# Altium project pca10143.PrjPCB (part 4 of 5)

## Sheet pca10143_sheet6_power_supply.SchDoc: PCA10143 - Power Supply
size A3; Organization: Nordic Semiconductor; DocumentNumber: 6; Revision: 0.7.2; SheetNumber: 6; SheetTotal: 7; Author: HANY; CompanyName: Nordic Semiconductor; ProjectName: nRF7002 Development Kit
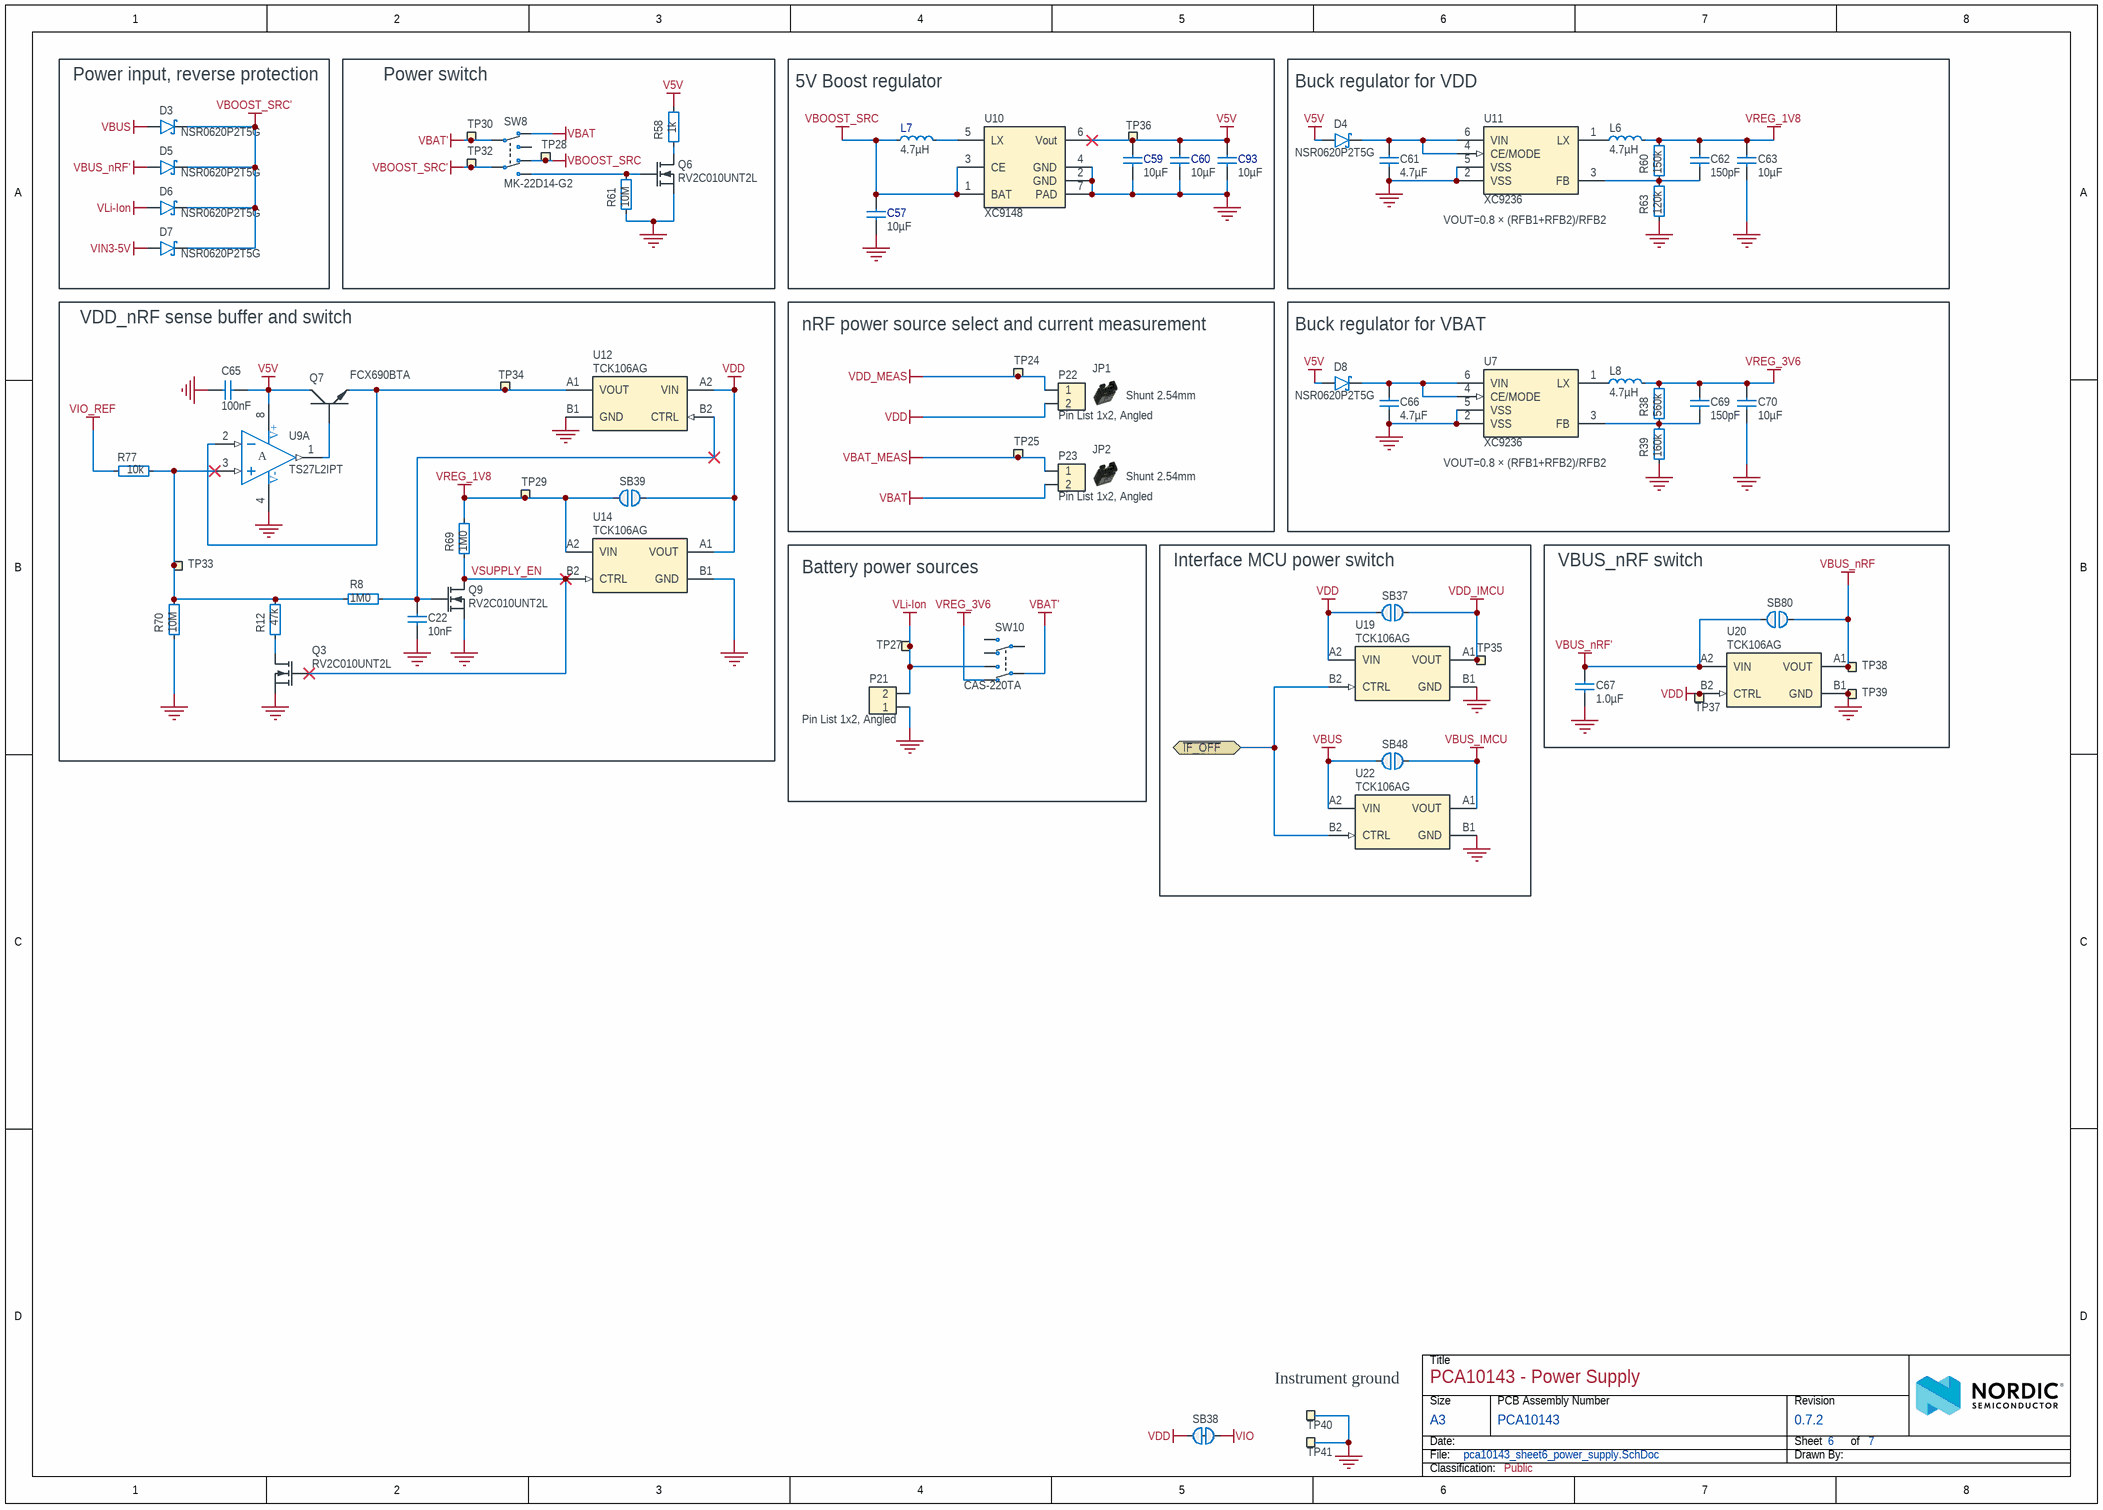
[diagram p5: pca10143_sheet6_power_supply.SchDoc]

### Parts
C22  10nF  [CAPC0603X03L_C]
C57  10µF  [CAPC1608X06L]
C59  10µF  [CAPC1608X06L]
C60  10µF  [CAPC1608X06L]
C61  4.7µF  [CAPC1005X04L]
C62  150pF  [CAPC0603X03L_C]
C63  10µF  [CAPC1608X06L]
C65  100nF  [CAPC0603X03L_C]
C66  4.7µF  [CAPC1005X04L]
C67  1.0µF  [CAPC1608X06L]
C69  150pF  [CAPC0603X03L_C]
C70  10µF  [CAPC1608X06L]
C93  10µF  [CAPC1608X06L]
D3  NSR0620P2T5G  [SODFL100X40-2N]
D4  NSR0620P2T5G  [SODFL100X40-2N]
D5  NSR0620P2T5G  [SODFL100X40-2N]
D6  NSR0620P2T5G  [SODFL100X40-2N]
D7  NSR0620P2T5G  [SODFL100X40-2N]
D8  NSR0620P2T5G  [SODFL100X40-2N]
JP1  Shunt 2.54mm  [Shunt_2.54mm_Horizontal]
JP2  Shunt 2.54mm  [Shunt_2.54mm_Horizontal]
L6  4.7µH  [TY-NR3015]
L7  4.7µH  [VLS3012HBX]
L8  4.7µH  [TY-NR3015]
P21  Pin List 1x2, Angled  [LIST_ANG_1x2-SMD-2.54MM]
P22  Pin List 1x2, Angled  [LIST_ANG_1x2-SMD-2.54MM]
P23  Pin List 1x2, Angled  [LIST_ANG_1x2-SMD-2.54MM]
Q3  RV2C010UNT2L  [DFN65P100X40-3L]
Q6  RV2C010UNT2L  [DFN65P100X40-3L]
Q7  FCX690BTA  [SOT89-150P409X160-3N]
Q9  RV2C010UNT2L  [DFN65P100X40-3L]
R8  1M0  [RESC0603X03L_C]
R12  47k  [RESC0603X03L_C]
R38  560k  [RESC0603X03L_C]
R39  160k  [RESC0603X03L_C]
R58  1k  [RESC0603X03L_C]
R60  150k  [RESC0603X03L_C]
R61  10M  [RESC0603X03L_C]
R63  120k  [RESC0603X03L_C]
R69  1M0  [RESC0603X03L_C]
R70  10M  [RESC0603X03L_C]
R77  10k  [RESC0603X03L_C]
SB37  Solderbridge  [Solderbridge]  (value not drawn)  (no BOM)
SB38  Solderbridge  [Solderbridge_Shorted]  (value not drawn)  (net tie, no BOM)
SB39  Solderbridge  [Solderbridge]  (value not drawn)  (no BOM)
SB48  Solderbridge  [Solderbridge]  (value not drawn)  (no BOM)
SB80  Solderbridge  [Solderbridge]  (value not drawn)  (no BOM)
SW8  MK-22D14-G2  [MK-22D14-G2]
SW10  CAS-220TA  [CAS-220TA]
TP24  Ø1.5mm,SMD  [TP_SMD_D1.5mm]  (value not drawn)  (no BOM)
TP25  Ø1.5mm,SMD  [TP_SMD_D1.5mm]  (value not drawn)  (no BOM)
TP27  Ø1.5mm,SMD  [TP_SMD_D1.5mm]  (value not drawn)  (no BOM)
TP28  Ø1.5mm,SMD  [TP_SMD_D1.5mm]  (value not drawn)  (no BOM)
TP29  Ø1.0mm,SMD  [TP_SMD_D1.0mm]  (value not drawn)  (no BOM)
TP30  Ø1.5mm,SMD  [TP_SMD_D1.5mm]  (value not drawn)  (no BOM)
TP32  Ø1.5mm,SMD  [TP_SMD_D1.5mm]  (value not drawn)  (no BOM)
TP33  Ø1.0mm,SMD  [TP_SMD_D1.0mm]  (value not drawn)  (no BOM)
TP34  Ø1.0mm,SMD  [TP_SMD_D1.0mm]  (value not drawn)  (no BOM)
TP35  Ø1.5mm,SMD  [TP_SMD_D1.5mm]  (value not drawn)  (no BOM)
TP36  Ø1.0mm,SMD  [TP_SMD_D1.0mm]  (value not drawn)  (no BOM)
TP37  Ø1.5mm,SMD  [TP_SMD_D1.5mm]  (value not drawn)  (no BOM)
TP38  Ø1.5mm,SMD  [TP_SMD_D1.5mm]  (value not drawn)  (no BOM)
TP39  Ø1.5mm,SMD  [TP_SMD_D1.5mm]  (value not drawn)  (no BOM)
TP40  TP  [TESTPAD-TH]  (value not drawn)  (no BOM)
TP41  TP  [TESTPAD-TH]  (value not drawn)  (no BOM)
U7  XC9236  [USP-6C]
U9  TS27L2IPT  [TSOP65P640X120-8N]  (part A of 2)
U10  XC9148  [USP-6C]
U11  XC9236  [USP-6C]
U12  TCK106AG  [BGA4C40P2X2_76X76X62]
U14  TCK106AG  [BGA4C40P2X2_76X76X62]
U19  TCK106AG  [BGA4C40P2X2_76X76X62]
U20  TCK106AG  [BGA4C40P2X2_76X76X62]
U22  TCK106AG  [BGA4C40P2X2_76X76X62]

### Blocks framed on the sheet
Power input, reverse protection: D3 D5-D7
Power switch: Q6 R58 R61 SW8 TP28 TP30 TP32
5V Boost regulator: C57 C59 C60 C93 L7 TP36 U10
Buck regulator for VDD: C61-C63 D4 L6 R60 R63 U11
VDD_nRF sense buffer and switch: C22 C65 Q3 Q7 Q9 R8 R12 R69 R70 R77 SB39 TP29 TP33 TP34 U9 U12 U14
nRF power source select and current measurement: JP1 JP2 P22 P23 TP24 TP25
Buck regulator for VBAT: C66 C69 C70 D8 L8 R38 R39 U7
Battery power sources: P21 SW10 TP27
Interface MCU power switch: SB37 SB48 TP35 U19 U22
VBUS_nRF switch: C67 SB80 TP37-TP39 U20

### Ports
~{IF_OFF} (bidir)

### Nets
GND: C22.2 C57.1 C59.1 C60.1 C61.1 C63.1 C65.1 C66.1 C67.1 C70.1 C93.1 P21.1 Q3.2(S) Q6.2(S) Q9.2(S) R39.1 R61.2 R63.1 R70.2 TP39.1 TP40.1 TP41.1 U7.2(VSS) U7.5(VSS) U7.7(VSS) U9.4(V-) U10.2(GND) U10.4(GND) U10.7(PAD) U11.2(VSS) U11.5(VSS) U11.7(VSS) U12.B1(GND) U14.B1(GND) U19.B1(GND) U20.B1(GND) U22.B1(GND)
V5V: C59.2 C60.2 C65.2 C93.2 D4.2(A) D8.2(A) Q7.2(C) R58.1 TP36.1 U9.8(V+) U10.6(Vout)
VBAT: P23.2 SW8.3(N.C-1)
VBAT': SW8.2(COM-1) SW10.2(COM-1) TP30.1
VBAT_MEAS: P23.1 TP25.1
VBOOST_SRC: C57.2 L7.1 SW8.6(N.C-2) TP28.1 U10.1(BAT) U10.3(CE)
VBOOST_SRC': D3.1(C) D5.1(C) D6.1(C) D7.1(C) SW8.5(COM-2) TP32.1
VBUS: D3.2(A) SB48.2 U22.A2(VIN)
VBUS_IMCU: SB48.1 U22.A1(VOUT)
VBUS_nRF: SB80.1 TP38.1 U20.A1(VOUT)
VBUS_nRF': C67.2 D5.2(A) SB80.2 U20.A2(VIN)
VDD: P22.2 SB37.2 SB38.2 SB39.1 TP37.1 U12.A2(VIN) U14.A1(VOUT) U19.A2(VIN) U20.B2(CTRL)
VDD_IMCU: SB37.1 TP35.1 U19.A1(VOUT)
VDD_MEAS: P22.1 TP24.1
VIN3-5V: D7.2(A)
VIO: SB38.1
VIO_REF: R77.2
VLi-Ion: D6.2(A) P21.2 SW10.1(N.O-1) TP27.1
VREG_1V8: C62.2 C63.2 L6.2 R60.2 R69.1 SB39.2 TP29.1 U14.A2(VIN)
VREG_3V6: C69.2 C70.2 L8.2 R38.2 SW10.3(N.C-1)
~{IF_OFF}: U19.B2(CTRL) U22.B2(CTRL) ; port ~{IF_OFF}
VSUPPLY_EN: Q3.1(G) Q9.3(D) R69.2 U14.B2(CTRL)
NetC22_1: C22.1 Q9.1(G) R8.2 U12.B2(CTRL)
NetC61_2: C61.2 D4.1(C) U11.4(CE/MODE) U11.6(VIN)
NetC62_1: C62.1 R60.1 R63.2 U11.3(FB)
NetC66_2: C66.2 D8.1(C) U7.4(CE/MODE) U7.6(VIN)
NetC69_1: C69.1 R38.1 R39.2 U7.3(FB)
NetL6_1: L6.1 U11.1(LX)
NetL7_2: L7.2 U10.5(LX)
NetL8_1: L8.1 U7.1(LX)
NetQ3_3: Q3.3(D) R12.2
NetQ6_1: Q6.1(G) R61.1 SW8.4(N.O-2)
NetQ6_3: Q6.3(D) R58.2
NetQ7_1: Q7.1(B) U9.1(OUT1)
NetQ7_3: Q7.3(E) TP34.1 U9.2(IN1-) U12.A1(VOUT)
NetR8_1: R8.1 R12.1 R70.1 R77.1 TP33.1 U9.3(IN1+)

Not connected (* = marked no-connect by the designer): SW8 1(N.O-1); SW10 4(N.O-2) 5(COM-2) 6(N.C-2)

### Notes on the sheet
- VOUT=0.8 × (RFB1+RFB2)/RFB2
- (near TP40) Instrument ground
- Title
- Size
- Date:
- File:
- A3
- PCB Assembly Number
- Sheet         of
- Drawn By:
- Revision
- Classification:
- (in symbol TS27L2IPT, part A) A

### Library data of the parts
C22 = C0201-10n: Capacitor, X7R, ±10%; Manufacturer: N.A.; Part number IPS: 00000003480; Part number Norautron: 26621779; Part number NEMS: 100200067; Note: 10V; Pad Count: 2; Component Status: Active; Part Number: C0201-10n; LatestRevisionDate: 2017-11-09; Published: 2014-11-13; Value: 10nF; Footprint Doc: 0201; Manufacturer Part Number: N.A.; Artikkelnr Noca: N.A.; ComponentLink1URL: N.A.; ComponentLink1Description: Datasheet; ComponentLink2URL: N.A.; ComponentLink2Description: Supplier link; HelpURL: N.A.; Supplier 1: N.A.; Supplier Part Number 1: N.A.; Supplier 2: N.A.; Supplier Part Number 2: N.A.; Component Class: Capacitors; PartId: 100200067; Author: rsk
C57 C59 C60 C93 = C0603-10µ-25V-X5R-CL10A106MA8NRNC: Capacitor, X5R, ±20%, 25V; Manufacturer: Samsung Electro-Mechanics America; Part number IPS: 00000009948; Part number Norautron: N.A.; Part number NEMS: 100200354; Artikkelnr Noca: 20039436; Pad Count: 2; Component Status: Active; Part Number: C0603-10µ-25V-X5R-CL10A106MA8NRNC; Manufacturer Part Number: CL10A106MA8NRNC; Footprint Doc: 0603; LatestRevisionDate: 2021-07-21; Published: 2015-04-10; Value: 10µF; Note: 25V; ComponentLink1URL: N.A.; ComponentLink1Description: Datasheet; ComponentLink2URL: N.A.; ComponentLink2Description: Supplier link; HelpURL: http://www.samsungsem.com/kr/front/downloadcms.do?path=/kr/support/product-search/mlcc/__icsFiles/afieldfile/2014/11/05&fileName=S_CL10A106MA8NRNC.pdf; Supplier 1: Digi-Key; Supplier Part Number 1: 1276-1869-1-ND; Supplier 2: N.A.; Supplier Part Number 2: N.A.; PartId: 100200354; Component Class: Capacitors; Author: rsk
C61 C66 = C0402-4µ7-10V-X5R: Capacitor, X5R, 10V; Manufacturer: Murata; Manufacturer Part Number: GRM155R61A475MEAAD; Part number NEMS: 100200415; Artikkelnr Noca: N.A.; Pad Count: 2; Component Status: Active; Part Number: C0402-4µ7-10V-X5R; ComponentLink1URL: http://search.murata.co.jp/Ceramy/image/img/A01X/G101/ENG/GRM155R61A475MEAA-01.pdf; ComponentLink1Description: Datasheet; ComponentLink2URL: https://www.digikey.com/product-detail/en/murata-electronics-north-america/GRM155R61A475MEAAD/490-14306-1-ND/6234742; ComponentLink2Description: Supplier link; HelpURL: https://psearch.en.murata.com/capacitor/product/GRM155R61A475MEAA%23.html; Footprint Doc: 0402; LatestRevisionDate: 2020-10-13; Published: 2018-10-04; Value: 4.7µF; Note: 10V; Supplier 1: Digi-Key; Supplier Part Number 1: 490-14306-1-ND; Supplier 2: N.A.; Supplier Part Number 2: N.A.; Part number IPS: N.A.; Component Class: Capacitors; PartId: 100200415; Author: rsk; Part number Norautron: N.A.
C62 C69 = C0201-150p-25V-COG-GRM0335C1E151JA01D: Capacitor, Ceramic, NP0, ±5%, 25V; Manufacturer: Murata; Part number IPS: 00000004306; Part number NEMS: 100200444; Note: Chip Cap 5%; Artikkelnr Noca: N.A.; Pad Count: 2; Component Status: Active; Part Number: C0201-150p-25V-COG-GRM0335C1E151JA01D; Manufacturer Part Number: GRM0335C1E151JA01D; Footprint Doc: 0201; LatestRevisionDate: 2020-10-13; Published: 2020-03-17; Value: 150pF; ComponentLink1URL: https://www.mouser.com/datasheet/2/281/murata_03052018_GRM_Series_1-1310166.pdf; ComponentLink1Description: Datasheet; ComponentLink2URL: https://www.mouser.com/ProductDetail/Murata-Electronics/GRM0335C1E151JA01D?qs=%2Fha2pyFaduiNjPL6xbzKSo%252BchgTMqklsGrBRdYVX326W%252BRpjq1WqAQZ5mC%252Bu6szW; ComponentLink2Description: Supplier link; HelpURL: N.A.; Supplier 1: Mouser; Supplier Part Number 1: 81-GRM0335C1E151JA1D; Supplier 2: Mouser; Supplier Part Number 2: 490-GRM0335C1E151JA01DTR-ND; Component Class: Capacitors; PartId: 100200444; Author: getr; Part number Norautron: N.A.
C63 C70 = C0603-10µ-25V-X5R-GRM188R61E106MA73J: Capacitor, Ceramic, X5R, ±20%, 25V; Manufacturer: Murata; Part number NEMS: 100200456; Artikkelnr Noca: N.A.; Pad Count: 2; Component Status: Active; Part Number: C0603-10µ-25V-X5R-GRM188R61E106MA73J; Manufacturer Part Number: GRM188R61E106MA73J; Footprint Doc: 0603; LatestRevisionDate: 2021-07-22; Published: 2020-12-16; Value: 10µF; Note: 25V; Part number IPS: N.A.; ComponentLink1URL: https://search.murata.co.jp/Ceramy/image/img/A01X/G101/ENG/GRM188R61E106MA73-01.pdf; ComponentLink1Description: Datasheet; ComponentLink2URL: https://www.murata.com/en-global/products/productdetail?partno=GRM188R61E106MA73%23; ComponentLink2Description: Supplier link; HelpURL: N.A.; Supplier 1: Digi-Key; Supplier Part Number 1: 490-12737-1-ND; Supplier 2: Mouser; Supplier Part Number 2: 81-GRM188R61E106MA3J; PartId: 100200456; Component Class: Capacitors; Author: rsk; Part number Norautron: N.A.
C65 = C0201-100n: Capacitor, X5R, ±10%; Manufacturer: N.A.; Part number IPS: 00000001248, 00000002505; Part number Norautron: 262071862; Part number NEMS: 100200078; Note: 16V; Pad Count: 2; Component Status: Active; Part Number: C0201-100n; Manufacturer Part Number: N.A.; Footprint Doc: 0201; LatestRevisionDate: 2017-11-09; Published: 2014-11-13; Value: 100nF; Artikkelnr Noca: N.A.; ComponentLink1URL: N.A.; ComponentLink1Description: Datasheet; ComponentLink2URL: N.A.; ComponentLink2Description: Supplier link; HelpURL: N.A.; Supplier 1: N.A.; Supplier Part Number 1: N.A.; Supplier 2: N.A.; Supplier Part Number 2: N.A.; Component Class: Capacitors; PartId: 100200078; Author: rsk
C67 = C0603-1µ0: Capacitor, X7R, ±10%; Manufacturer: N.A.; Part number IPS: 00000000616; Part number Norautron: 262083409; Part number NEMS: 100200271; Note: 16V; Artikkelnr Noca: 20039282; Pad Count: 2; Component Status: Active; Part Number: C0603-1µ0; Manufacturer Part Number: N.A.; Footprint Doc: 0603; LatestRevisionDate: 2013-06-05; Published: 2009-05-08; Value: 1.0µF; ComponentLink1URL: N.A.; ComponentLink1Description: Datasheet; ComponentLink2URL: N.A.; ComponentLink2Description: Supplier link; HelpURL: N.A.; Supplier 1: N.A.; Supplier Part Number 1: N.A.; Supplier 2: N.A.; Supplier Part Number 2: N.A.; Component Class: Capacitors; PartId: 100200271; Author: rsk
D3-D8 = NSR0620P2T5G: 20V schottky barrier diode, Vf 350 mV @ 100 mA, Ir 2.0 µA @ 10 V, If 500 mA; Manufacturer: ON Semiconductor; Part number IPS: 00000009952; Part number Norautron: 26311081; Part number NEMS: 101300131; Note: N.A.; Artikkelnr Noca: 10029169; Pad Count: 2; Component Status: Active; Part Number: NSR0620P2T5G; Manufacturer Part Number: NSR0620P2T5G; LatestRevisionDate: 2016-07-07; Published: 2016-07-07; Value: NSR0620P2T5G; Footprint Doc: SOD-923; ComponentLink1URL: N.A.; ComponentLink1Description: Datasheet; ComponentLink2URL: N.A.; ComponentLink2Description: Supplier link; HelpURL: http://www.onsemi.com/pub_link/Collateral/NSR0620P2-D.PDF; Supplier 1: Digi-Key; Supplier Part Number 1: NSR0620P2T5GOSCT-ND; Supplier 2: N.A.; Supplier Part Number 2: N.A.; Component Class: Semiconductors; PartId: 101300131; Author: rsk
JP1 JP2 = SHUNT JUMPER 2.54mm Black Tin: Shunt Jumper 2.54mm Black, open top; Manufacturer: Samtec; Manufacturer Part Number: SNT-100-BK-T; Part number NEMS: 100500728; Pad Count: 2; Note: SHUNT JUMPER .1" BLACK TIN, h=6.10mm, w=5.08mm; Artikkelnr Noca: N.A.; Component Status: Active; Part Number: SHUNT JUMPER 2.54mm Black Tin; PartId: 100500728; Component Class: Connectors; Author: masi; ComponentLink1URL: N.A.; ComponentLink1Description: Datasheet; ComponentLink2URL: N.A.; ComponentLink2Description: Supplier link; HelpURL: http://suddendocs.samtec.com/catalog_english/snt.pdf; Footprint Doc: SHUNT JUMPER 2.54mm; LatestRevisionDate: 2021-06-28; Published: 2021-06-28; Value: Shunt 2.54mm; Supplier 1: Digi-Key; Supplier Part Number 1: SAM8860-ND; Supplier 2: Mouser; Supplier Part Number 2: 200-SNT100BKT; Part number IPS: N.A.; Part number Norautron: N.A.
L6 L8 = NR3015-4µ7-1.04A-144mOhm: Ferrite Inductor, Shielded, 1,04A, 144mOhm; Manufacturer: Taiyo Yuden; Manufacturer Part Number: NR3015T4R7M; Part number IPS: 00000009960; Part number NEMS: 100300145; Note: N.A.; Artikkelnr Noca: 33029551; Pad Count: 2; Component Status: Active; Part Number: NR3015-4µ7-1.04A-144mOhm; Footprint Doc: 1212; LatestRevisionDate: 2014-01-22; Published: 2014-01-22; Value: 4.7µH; ComponentLink1Description: Datasheet; ComponentLink2Description: Supplier link; ComponentLink1URL: N.A.; ComponentLink2URL: N.A.; HelpURL: http://www.yuden.co.jp/ut/product/category/inductor/NR3015T4R7M.pdf; Supplier 1: Digi-Key; Supplier Part Number 1: 587-1649-1-ND; Supplier 2: Mouser; Supplier Part Number 2: 963-NR3015T4R7M; Component Class: Inductors; PartId: 100300145; Author: rsk; Part number Norautron: N.A.
L7 = VLS3012HBX-4R7M-N: 4.7µH Shielded Wirewound Inductor 2.23A 201 mOhm Max Nonstandard; Manufacturer: TDK Corporation; Part number NEMS: 100300407; Note: N.A.; Pad Count: 2; Component Status: Active; Part Number: VLS3012HBX-4R7M-N; Manufacturer Part Number: VLS3012HBX-4R7M-N; Footprint Doc: VLS3012HBX; LatestRevisionDate: 2022-02-09; Published: 2022-02-09; Value: 4.7µH; Artikkelnr Noca: N.A.; Part number IPS: N.A.; ComponentLink1Description: Datasheet; ComponentLink2Description: Supplier link; ComponentLink1URL: N.A.; ComponentLink2URL: N.A.; HelpURL: https://product.tdk.com/en/search/inductor/inductor/smd/info?part_no=VLS3012HBX-4R7M-N; Supplier 1: Digi-Key; Supplier Part Number 1: 445-VLS3012HBX-4R7M-NTR-ND; Supplier 2: Mouser; Supplier Part Number 2: 810-VLS3012HBX4R7M-N; Component Class: Inductors; PartId: 100300407; Author: stl1; Part number Norautron: N.A.
P21-P23 = Pin List Ang 1x2 SMD, 2.54mm: Pin List 1x2, 2.54mm (100mil), Right Angled, SMD; Manufacturer: W-CON; Manufacturer Part Number: 1125B-1102S0Z135R2; Part number IPS: 00000009972; Part number NEMS: 100500354; Note: N.A.; Artikkelnr Noca: 55010023; Pad Count: 2; Component Status: Active; Part Number: Pin List Ang 1x2 SMD, 2.54mm; Footprint Doc: LIST_ANG_1x2-SMD-2.54MM; LatestRevisionDate: 2016-05-26; Published: 2016-01-22; Value: Pin List 1x2, Angled; ComponentLink1URL: N.A.; ComponentLink1Description: Datasheet; ComponentLink2URL: N.A.; ComponentLink2Description: Supplier link; HelpURL: \\hizz\pro\app9717\Datasheet\connectors\W-CON\1125B-11XXXXZXXXXX.pdf; Supplier 1: Cabcon; Supplier Part Number 1: 1125B-1102S0Z135R2; Supplier 2: Samtec; Supplier Part Number 2: TSM-102-01-L-SH-A; Component Class: Connectors; PartId: 100500354; Author: rsk; Part number Norautron: N.A.
Q3 Q6 Q9 = RV2C010UNT2L: N-Channel MOSFET, 20V, 1A, 470mOhm, 400mW; Manufacturer: Rohm Semiconductor; Part number IPS: 00000009976; Part number Norautron: 26320026; Part number NEMS: 101300132; Note: N.A.; Artikkelnr Noca: 35010020; Pad Count: 3; Component Status: Active; Part Number: RV2C010UNT2L; Manufacturer Part Number: RV2C010UNT2L; LatestRevisionDate: 2016-08-09; Published: 2016-08-09; Value: RV2C010UNT2L; Footprint Doc: DFN-3; ComponentLink1URL: N.A.; ComponentLink1Description: Datasheet; ComponentLink2URL: N.A.; ComponentLink2Description: Supplier link; HelpURL: http://rohmfs.rohm.com/en/products/databook/datasheet/discrete/transistor/mosfet/rv2c010unt2l-e.pdf; Supplier 1: Digi-Key; Supplier Part Number 1: RV2C010UNT2LCT-ND; Supplier 2: Mouser; Supplier Part Number 2: 755-RV2C010UNT2L; Component Class: Semiconductors; PartId: 101300132; Author: rsk
Q7 = FCX690BTA: 45V NPN high gain power transistor; Manufacturer: Diodes Incorporated; Part number IPS: 00000009974; Part number NEMS: 101300130; Note: N.A.; Artikkelnr Noca: 35010019; Pad Count: 3; Component Status: Active; Part Number: FCX690BTA; Manufacturer Part Number: FCX690BTA; Footprint Doc: SOT-89; LatestRevisionDate: 2016-07-07; Published: 2016-07-07; Value: FCX690BTA; ComponentLink1URL: N.A.; ComponentLink1Description: Datasheet; ComponentLink2URL: N.A.; ComponentLink2Description: Supplier link; HelpURL: http://www.diodes.com/_files/datasheets/FCX690B.pdf; Supplier 1: Digi-Key; Supplier Part Number 1: FCX690BCT-ND; Supplier 2: N.A.; Supplier Part Number 2: N.A.; Component Class: Semiconductors; PartId: 101300130; Author: rsk; Part number Norautron: N.A.
R8 R69 = R0201-1M0: Resistor, ±1%, 0.05W; Manufacturer: N.A.; Part number IPS: 00000001418; Part number Norautron: 26107108; Part number NEMS: 100100093; Note: Chip Res 1%; Pad Count: 2; Component Status: Active; Part Number: R0201-1M0; Manufacturer Part Number: N.A.; LatestRevisionDate: 2014-11-13; Published: 2014-11-13; Value: 1M0; Artikkelnr Noca: N.A.; Footprint Doc: 0201; ComponentLink1URL: N.A.; ComponentLink1Description: Datasheet; ComponentLink2URL: N.A.; ComponentLink2Description: Supplier link; HelpURL: N.A.; Supplier 1: N.A.; Supplier Part Number 1: N.A.; Supplier 2: N.A.; Supplier Part Number 2: N.A.; Component Class: Resistors; PartId: 100100093; Author: rsk
R12 = R0201-47k: Resistor, ±1%, 0.05W; Manufacturer: N.A.; Part number IPS: 00000001423; Part number NEMS: 100100076; Note: Chip Res 1%; Pad Count: 2; Component Status: Active; Part Number: R0201-47k; Manufacturer Part Number: N.A.; LatestRevisionDate: 2014-11-13; Published: 2014-11-13; Value: 47k; Artikkelnr Noca: N.A.; Footprint Doc: 0201; ComponentLink1URL: N.A.; ComponentLink1Description: Datasheet; ComponentLink2URL: N.A.; ComponentLink2Description: Supplier link; HelpURL: N.A.; Supplier 1: N.A.; Supplier Part Number 1: N.A.; Supplier 2: N.A.; Supplier Part Number 2: N.A.; Component Class: Resistors; PartId: 100100076; Author: rsk; Part number Norautron: N.A.
R38 = R0201-560k: Resistor, ±1%, 0.05W; Manufacturer: N.A.; Part number IPS: 00000004799; Part number NEMS: 100100090; Note: Chip Res 1%; Pad Count: 2; Component Status: Active; Part Number: R0201-560k; Manufacturer Part Number: N.A.; Footprint Doc: 0201; LatestRevisionDate: 2014-11-13; Published: 2014-11-13; Value: 560k; Artikkelnr Noca: N.A.; ComponentLink1URL: N.A.; ComponentLink1Description: Datasheet; ComponentLink2URL: N.A.; ComponentLink2Description: Supplier link; HelpURL: N.A.; Supplier 1: N.A.; Supplier Part Number 1: N.A.; Supplier 2: N.A.; Supplier Part Number 2: N.A.; Component Class: Resistors; PartId: 100100090; Author: rsk; Part number Norautron: N.A.
R39 = R0201-160k: Resistor, ±1%, 0.05W; Manufacturer: N.A.; Part number NEMS: 100100657; Component Status: Active; Pad Count: 2; Note: Chip Res 1%; Part Number: R0201-160k; Component Class: Resistors; Author: hany; Manufacturer Part Number: N.A.; ComponentLink1URL: N.A.; ComponentLink1Description: Datasheet; ComponentLink2URL: N.A.; ComponentLink2Description: Supplier link; HelpURL: N.A.; Footprint Doc: 0201; LatestRevisionDate: 2022-03-28; Published: 2022-03-28; Value: 160k; Supplier 1: N.A.; Supplier Part Number 1: N.A.; Supplier 2: N.A.; Supplier Part Number 2: N.A.; Artikkelnr Noca: N.A.; Part number IPS: N.A.; Part number Norautron: N.A.; PartId: 100100657
R58 = R0201-1k0: Resistor, ±1%, 0.05W; Manufacturer: N.A.; Part number IPS: 00000005786; Part number NEMS: 100100043; Note: Chip Res 1%; Pad Count: 2; Component Status: Active; Part Number: R0201-1k0; Manufacturer Part Number: N.A.; LatestRevisionDate: 2014-11-13; Published: 2014-11-13; Value: 1k; Artikkelnr Noca: N.A.; Footprint Doc: 0201; ComponentLink1URL: N.A.; ComponentLink1Description: Datasheet; ComponentLink2URL: N.A.; ComponentLink2Description: Supplier link; HelpURL: N.A.; Supplier 1: N.A.; Supplier Part Number 1: N.A.; Supplier 2: N.A.; Supplier Part Number 2: N.A.; Component Class: Resistors; PartId: 100100043; Author: rsk; Part number Norautron: N.A.
R60 = R0201-150k: Resistor, ±1%, 0.05W; Manufacturer: N.A.; Part number IPS: 00000001422; Part number NEMS: 100100082; Note: Chip Res 1%; Pad Count: 2; Component Status: Active; Part Number: R0201-150k; Manufacturer Part Number: N.A.; Footprint Doc: 0201; LatestRevisionDate: 2014-11-13; Published: 2014-11-13; Value: 150k; Artikkelnr Noca: N.A.; ComponentLink1URL: N.A.; ComponentLink1Description: Datasheet; ComponentLink2URL: N.A.; ComponentLink2Description: Supplier link; HelpURL: N.A.; Supplier 1: N.A.; Supplier Part Number 1: N.A.; Supplier 2: N.A.; Supplier Part Number 2: N.A.; Component Class: Resistors; PartId: 100100082; Author: rsk; Part number Norautron: N.A.
R61 R70 = R0201-10M: Resistor, ±1%, 0.05W; Manufacturer: N.A.; Part number IPS: 00000001426; Part number NEMS: 100100105; Note: Chip Res 1%; Pad Count: 2; Component Status: Active; Part Number: R0201-10M; Manufacturer Part Number: N.A.; LatestRevisionDate: 2014-11-13; Published: 2014-11-13; Value: 10M; Artikkelnr Noca: N.A.; Footprint Doc: 0201; ComponentLink1URL: N.A.; ComponentLink1Description: Datasheet; ComponentLink2URL: N.A.; ComponentLink2Description: Supplier link; HelpURL: N.A.; Supplier 1: N.A.; Supplier Part Number 1: N.A.; Supplier 2: N.A.; Supplier Part Number 2: N.A.; Component Class: Resistors; PartId: 100100105; Author: rsk; Part number Norautron: N.A.
R63 = R0201-120k: Resistor, ±1%, 0.05W; Manufacturer: N.A.; Part number IPS: 00000001425; Part number NEMS: 100100081; Note: Chip Res 1%; Pad Count: 2; Component Status: Active; Part Number: R0201-120k; Manufacturer Part Number: N.A.; Footprint Doc: 0201; LatestRevisionDate: 2014-11-13; Published: 2014-11-13; Value: 120k; Artikkelnr Noca: N.A.; ComponentLink1URL: N.A.; ComponentLink1Description: Datasheet; ComponentLink2URL: N.A.; ComponentLink2Description: Supplier link; HelpURL: N.A.; Supplier 1: N.A.; Supplier Part Number 1: N.A.; Supplier 2: N.A.; Supplier Part Number 2: N.A.; Component Class: Resistors; PartId: 100100081; Author: rsk; Part number Norautron: N.A.
R77 = R0201-10k: Resistor, ±1%, 0.05W; Manufacturer: N.A.; Part number IPS: 00000001255; Part number Norautron: 26107101; Part number NEMS: 100100065; Note: Chip Res 1%; Pad Count: 2; Component Status: Active; Part Number: R0201-10k; Manufacturer Part Number: N.A.; LatestRevisionDate: 2014-11-13; Published: 2014-11-13; Value: 10k; Artikkelnr Noca: N.A.; Footprint Doc: 0201; ComponentLink1URL: N.A.; ComponentLink1Description: Datasheet; ComponentLink2URL: N.A.; ComponentLink2Description: Supplier link; HelpURL: N.A.; Supplier 1: N.A.; Supplier Part Number 1: N.A.; Supplier 2: N.A.; Supplier Part Number 2: N.A.; Component Class: Resistors; PartId: 100100065; Author: rsk
SB37 SB39 SB48 SB80 = Solderbridge: Manufacturer: N.A.; Part number NEMS: 100500458; Pad Count: 2; Component Status: Active; Part Number: Solderbridge; Manufacturer Part Number: N.A.; LatestRevisionDate: 2009-12-14; Published: 2009-12-14; Value: Solderbridge; Note: N.A.; Artikkelnr Noca: N.A.; Footprint Doc: Solderbridge; Part number IPS: N.A.; ComponentLink1URL: N.A.; ComponentLink1Description: Datasheet; ComponentLink2URL: N.A.; ComponentLink2Description: Supplier link; HelpURL: N.A.; Supplier 1: N.A.; Supplier Part Number 1: N.A.; Supplier 2: N.A.; Supplier Part Number 2: N.A.; Component Class: Connectors; PartId: 100500458; Author: rsk; Part number Norautron: N.A.
SB38 = Solderbridge Shorted: Shorted Solderbridge; Manufacturer: N.A.; Part number NEMS: 100500459; Pad Count: 2; Component Status: Active; Part Number: Solderbridge Shorted; Manufacturer Part Number: N.A.; LatestRevisionDate: 2012-08-07; Published: 2012-08-07; Value: Solderbridge; Note: N.A.; Artikkelnr Noca: N.A.; Footprint Doc: Solderbridge_Shorted; Part number IPS: N.A.; ComponentLink1URL: N.A.; ComponentLink1Description: Datasheet; ComponentLink2URL: N.A.; ComponentLink2Description: Supplier link; HelpURL: N.A.; Supplier 1: N.A.; Supplier Part Number 1: N.A.; Supplier 2: N.A.; Supplier Part Number 2: N.A.; Component Class: Connectors; PartId: 100500459; Author: rsk; Part number Norautron: N.A.
SW8 = MK-22D14-G2: Slide Switch DPDT; Manufacturer: HUA-JIE CORP.; Part number NEMS: 101500131; Note: N.A.; Pad Count: 6; Component Status: Active; Part Number: MK-22D14-G2; Manufacturer Part Number: MK-22D14-G2; Footprint Doc: MK-22D14-G2; LatestRevisionDate: 2020-10-06; Published: 2020-12-01; Value: MK-22D14-G2; Artikkelnr Noca: N.A.; Part number IPS: N.A.; ComponentLink1URL: N.A.; ComponentLink1Description: Datasheet; ComponentLink2URL: N.A.; ComponentLink2Description: Supplier link; HelpURL: N.A.; Supplier 1: Cabcon; Supplier Part Number 1: MK-22D14-G2; Supplier 2: N.A.; Supplier Part Number 2: N.A.; Component Class: Switches; PartId: 101500131; Author: rsk; Part number Norautron: N.A.
SW10 = CAS-220TA: Slide Switch DPDT J Hook; Manufacturer: Copal Electronics Inc; Part number IPS: 00000009983; Part number NEMS: 101500003; Note: N.A.; Artikkelnr Noca: 50019042; Pad Count: 6; Component Status: Active; Part Number: CAS-220TA; Manufacturer Part Number: CAS-220TA; Footprint Doc: CAS-220TA; LatestRevisionDate: 2010-02-18; Published: 2010-02-18; Value: CAS-220TA; ComponentLink1URL: N.A.; ComponentLink1Description: Datasheet; ComponentLink2URL: N.A.; ComponentLink2Description: Supplier link; HelpURL: http://media.digikey.com/pdf/Data%20Sheets/COPAL%20Electronics%20PDFs/CAS%20SMD%20Slide%20Switch.pdf; Supplier 1: Digi-Key; Supplier Part Number 1: CAS220JTR-ND; Supplier 2: N.A.; Supplier Part Number 2: N.A.; Component Class: Switches; PartId: 101500003; Author: rsk; Part number Norautron: N.A.
TP24 TP25 TP27 TP28 TP30 TP32 TP35 TP37-TP39 = TP_SMD_Ø1.5MM: as TP9-TP18 on sheet pca10143_sheet5_connectors; Part Number: TP_SMD_Ø1.5MM; LatestRevisionDate: 2021-03-05; Published: 2016-06-02; Value: Ø1.5mm,SMD; Note: N.A.; Artikkelnr Noca: N.A.; Footprint Doc: TP_SMD_Ø1.5mm; Part number IPS: N.A.; ComponentLink1URL: N.A.; ComponentLink1Description: Datasheet; ComponentLink2URL: N.A.; ComponentLink2Description: Supplier link; HelpURL: N.A.; Supplier 1: N.A.; Supplier Part Number 1: N.A.; Supplier 2: N.A.; Supplier Part Number 2: N.A.; Component Class: Connectors; PartId: 100500477; Author: rsk; Part number Norautron: N.A.
TP29 TP33 TP34 TP36 = TP_SMD_Ø1.0MM: 1.0mm circular SMD testpad; Manufacturer: Nordic Semiconductor; Manufacturer Part Number: N.A.; Part number NEMS: 100500475; Pad Count: 1; Component Status: Active; Part Number: TP_SMD_Ø1.0MM; LatestRevisionDate: 2021-03-05; Published: 2013-06-11; Value: Ø1.0mm,SMD; Note: N.A.; Artikkelnr Noca: N.A.; Footprint Doc: TP_SMD_Ø1.0mm; Part number IPS: N.A.; ComponentLink1URL: N.A.; ComponentLink1Description: Datasheet; ComponentLink2URL: N.A.; ComponentLink2Description: Supplier link; HelpURL: N.A.; Supplier 1: N.A.; Supplier Part Number 1: N.A.; Supplier 2: N.A.; Supplier Part Number 2: N.A.; Component Class: Connectors; PartId: 100500475; Author: rsk; Part number Norautron: N.A.
TP40 TP41 = Testpoint TH: Testpoint, through hole; Manufacturer: N.A.; Part number NEMS: 100500464; Pad Count: 1; Component Status: Active; Part Number: Testpoint TH; Manufacturer Part Number: N.A.; Footprint Doc: TESTPAD-TH; LatestRevisionDate: 2009-12-12; Published: 2009-12-12; Value: TP; Note: N.A.; Artikkelnr Noca: N.A.; Part number IPS: N.A.; ComponentLink1URL: N.A.; ComponentLink1Description: Datasheet; ComponentLink2URL: N.A.; ComponentLink2Description: Supplier link; HelpURL: N.A.; Supplier 1: N.A.; Supplier Part Number 1: N.A.; Supplier 2: N.A.; Supplier Part Number 2: N.A.; Component Class: Connectors; PartId: 100500464; Author: rsk; Part number Norautron: N.A.
U7 U11 = XC9236D08CER-G: 600mA Driver Transistor Built-In, Synchronous Step-Down DC/DC Converters; Manufacturer: Torex Semiconductor; Part number IPS: 00000004325; Part number NEMS: 101900207; Note: N.A.; Artikkelnr Noca: 17030085; Pad Count: 6; Component Status: Active; Part Number: XC9236D08CER-G; Manufacturer Part Number: XC9236D08CER-G; Footprint Doc: USP-6C; LatestRevisionDate: 2017-11-15; Published: 2017-11-15; Value: XC9236; ComponentLink1URL: N.A.; ComponentLink1Description: Datasheet; ComponentLink2URL: N.A.; ComponentLink2Description: Supplier link; HelpURL: http://www.torexsemi.com/products/dcdc_converters/data/XC9235~37.pdf; Supplier 1: Mouser; Supplier Part Number 1: 865-XC9236D08CER-G; Supplier 2: Digi-Key; Supplier Part Number 2: XC9236D08CER-G-ND; Component Class: Misc_ICs; PartId: 101900207; Author: rsk; Part number Norautron: N.A.
U9 = TS27L2IPT: Precision very low power CMOS dual operational amplifier; Manufacturer: STMicroelectronics; Part number IPS: 00000009991; Part number NEMS: 101900442; Note: N.A.; Artikkelnr Noca: 17010019; Pad Count: 8; Component Status: Active; Part Number: TS27L2IPT; Manufacturer Part Number: TS27L2IPT; Footprint Doc: TSSOP-8; LatestRevisionDate: 2016-07-07; Published: 2016-07-07; Value: TS27L2IPT; ComponentLink1URL: N.A.; ComponentLink1Description: Datasheet; ComponentLink2URL: N.A.; ComponentLink2Description: Supplier link; HelpURL: http://www.st.com/content/ccc/resource/technical/document/datasheet/38/5b/ca/bd/c0/26/4a/34/CD00000880.pdf/files/CD00000880.pdf/jcr:content/translations/en.CD00000880.pdf; Supplier 1: Digi-Key; Supplier Part Number 1: 497-8085-1-ND; Supplier 2: N.A.; Supplier Part Number 2: N.A.; Component Class: Misc_ICs; PartId: 101900442; Author: rsk; Part number Norautron: N.A.
U10 = XC9148A50CER-G: 1.4A Driver Transistor Built-In, Multi Functional Step-Up DC/DC Converter; Manufacturer: Torex Semiconductor; Part number NEMS: 101900670; Pad Count: 6; Note: N.A.; Component Status: Active; Part Number: XC9148A50CER-G; Component Class: Misc_ICs; Author: hany; Manufacturer Part Number: XC9148A50CER-G; ComponentLink1URL: https://www.torexsemi.com/file/XC9147/XC9147.pdf; ComponentLink1Description: Datasheet; ComponentLink2URL: N.A.; ComponentLink2Description: Supplier link; HelpURL: https://www.torexsemi.com/file/XC9147/XC9147.pdf; Footprint Doc: USP-6C; LatestRevisionDate: 2021-10-26; Published: 2021-10-26; Value: XC9148; Supplier 1: N.A.; Supplier Part Number 1: N.A.; Supplier 2: N.A.; Supplier Part Number 2: N.A.; Artikkelnr Noca: N.A.; Part number IPS: N.A.; Part number Norautron: N.A.; PartId: 101900670
U12 U14 U19 U20 U22 = TCK106AG: 1.0 A Load Switch IC with Slew Rate Control Driver in Ultra Small Package; Manufacturer: Toshiba; Manufacturer Part Number: TCK106AG,LF; Part number IPS: 00000004390; Part number Norautron: 26500627; Part number NEMS: 101900575; Note: N.A.; Pad Count: 4; Component Status: Active; Part Number: TCK106AG; ComponentLink1URL: https://toshiba.semicon-storage.com/info/docget.jsp?did=30131&prodName=TCK106AG; ComponentLink1Description: Datasheet; ComponentLink2URL: N.A.; ComponentLink2Description: Supplier link; HelpURL: N.A.; Footprint Doc: WLCSP-4; LatestRevisionDate: 2019-03-01; Published: 2019-02-17; Value: TCK106AG; Supplier 1: Digi-Key; Supplier Part Number 1: TCK106AGLFTR-ND; Supplier 2: Mouser; Supplier Part Number 2: 757-TCK106AGLF; Artikkelnr Noca: N.A.; Component Class: Misc_ICs; PartId: 101900575; Author: rsk